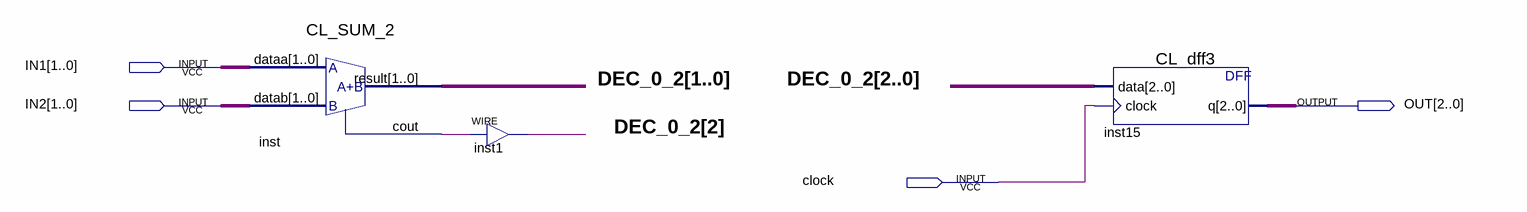
[diagram p0: schematic sheet]
// Quartus schematic CL_SUM2_BL.bdf as structural Verilog: 3 symbols, 4 pins
module CL_SUM2_BL (
  input  [1:0] IN1,
  input  [1:0] IN2,
  input  clock,
  output [2:0] OUT
);

  wire inst_cout;
  wire [2:0] DEC_0_2;

  CL_SUM_2 inst (.dataa(IN1), .datab(IN2), .result(DEC_0_2[1:0]), .cout(inst_cout));
  assign DEC_0_2[2] = inst_cout;  // WIRE inst1
  CL_dff3 inst15 (.data(DEC_0_2), .clock(clock), .q(OUT));
endmodule
